# EAGLE schematic v2 (EAGLE 6.6.0)
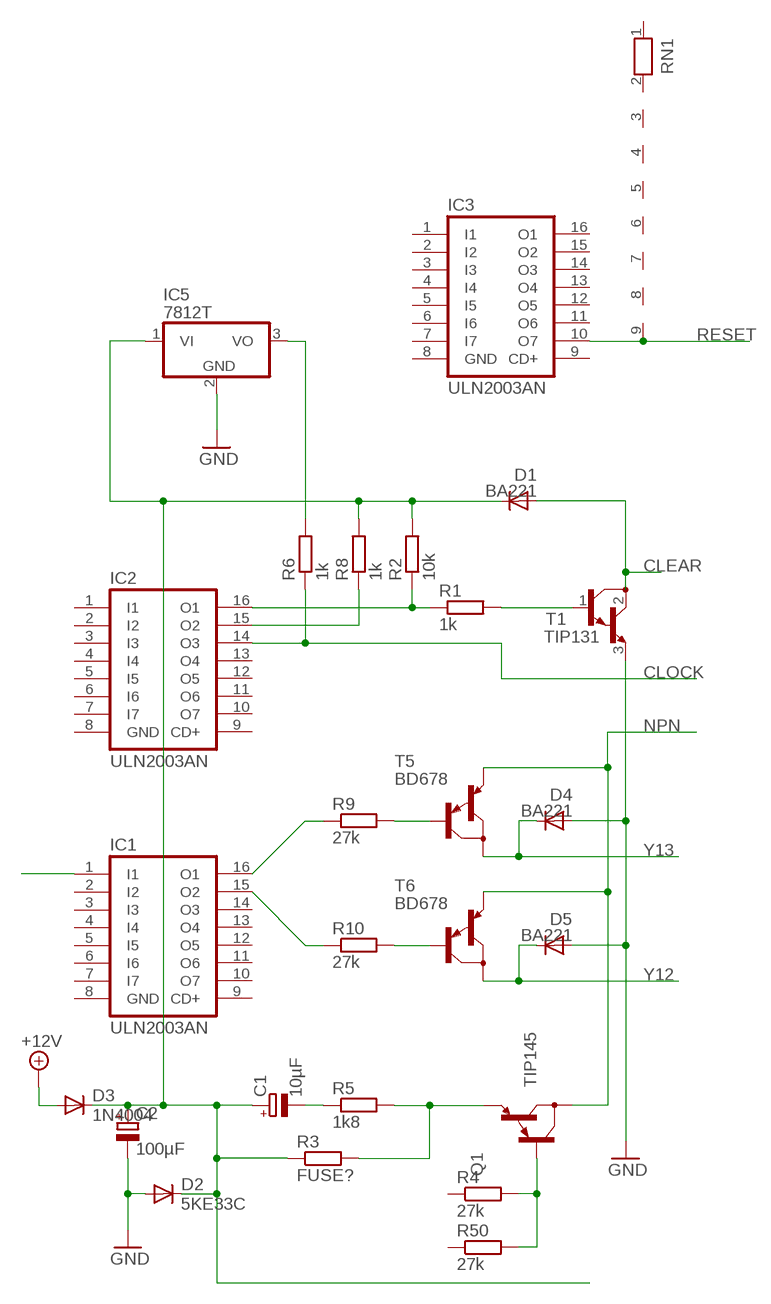
[diagram p0: schematic, sheet 1]

## Parts
C1  10µF  CPOL-EUE2.5-6  [E2,5-6]
C2  100µF  CPOL-EUE2.5-7  [E2,5-7]
D1  BA221  [DO35-10]
D2  5KE33C  1N4004  [DO41-10]
D3  1N4004  [DO41-10]
D4  BA221  [DO35-10]
D5  BA221  [DO35-10]
IC1  ULN2003AN  [DIL16]
IC2  ULN2003AN  [DIL16]
IC3  ULN2003AN  [DIL16]
IC5  7812T  [TO220H]
Q1  TIP145  TIP136  [TO220]
R1  1k  R-EU_0309/12  [0309/12]
R2  10k  R-EU_0309/12  [0309/12]
R3  FUSE?  R-EU_0309/12  [0309/12]
R4  27k  R-EU_0309/12  [0309/12]
R5  1k8  R-EU_0309/12  [0309/12]
R6  1k  R-EU_0309/12  [0309/12]
R8  1k  R-EU_0309/12  [0309/12]
R9  27k  R-EU_0309/12  [0309/12]
R10  27k  R-EU_0309/12  [0309/12]
R50  27k  R-EU_0309/12  [0309/12]
RN1  RN08  [RN-9]
T1  TIP131  [TO220]
T5  BD678  BD676  [TO126]
T6  BD678  BD676  [TO126]

## Nets
+12V: D3.A
CLEAR: D1.A T1.2(C)
CLOCK: IC2.14(O3) R6.1
GND: C2.- D2.A D4.A D5.A IC5.2(GND) T1.3(E)
N$1: R1.2 T1.1(B)
N$3: IC1.1(I1)
N$4: R9.2 T5.3(B)
N$5: Q1.1(B) R4.2 R50.2
N$6: Q1.3(E) R3.2 R5.2
N$7: C1.- R5.1
N$8: IC1.16(O1) R9.1
N$9: IC1.15(O2) R10.1
N$10: R10.2 T6.3(B)
N$11: IC2.15(O2) R8.1
N$12: IC2.16(O1) R1.1 R2.1
N$13: C1.+ C2.+ D1.C D2.C D3.C IC5.1(VI) R2.2 R3.1 R8.2
N$15: IC5.3(VO) R6.2
NPN: Q1.2(C) T5.1(E) T6.1(E)
RESET: IC3.10(O7) RN1.9
Y12: D5.C T6.2(C)
Y13: D4.C T5.2(C)
Unconnected: IC1.2(I2) IC1.3(I3) IC1.4(I4) IC1.5(I5) IC1.6(I6) IC1.7(I7) IC1.9(CD+) IC1.10(O7) IC1.11(O6) IC1.12(O5) IC1.13(O4) IC1.14(O3) IC2.1(I1) IC2.2(I2) IC2.3(I3) IC2.4(I4) IC2.5(I5) IC2.6(I6) IC2.7(I7) IC2.9(CD+) IC2.10(O7) IC2.11(O6) IC2.12(O5) IC2.13(O4) IC3.1(I1) IC3.2(I2) IC3.3(I3) IC3.4(I4) IC3.5(I5) IC3.6(I6) IC3.7(I7) IC3.9(CD+) IC3.11(O6) IC3.12(O5) IC3.13(O4) IC3.14(O3) IC3.15(O2) IC3.16(O1) R4.1 R50.1 RN1.1 RN1.2 RN1.3 RN1.4 RN1.5 RN1.6 RN1.7 RN1.8

## Power pins joined to a net without a drawn wire
GND: IC1.8(GND) IC2.8(GND) IC3.8(GND)

## Library data of the parts
C1 C2 = rcl:CPOL-EU: POLARIZED CAPACITOR, European symbol
D1 D4 D5 = diode:BA221: DIODE high speed (Philips)
D2 D3 = diode:1N4004: DIODE general purpose rectifier, 1 A
IC1-IC3 = uln-udn:ULN2003A: DRIVER ARRAY
IC5 = linear:78*: Positive VOLTAGE REGULATOR Source: http://cache.national.com/ds/LM/LM78L05.pdf http://www.fairchildsemi.com/ds/LM/LM7805.pdf
Q1 = transistor-pnp:TIP136: PNP Darlington Transistor
R1-R6 R8-R10 R50 = rcl:R-EU_: RESISTOR, European symbol
RN1 = resistor-net:RN08: RESISTOR NETWORK; OC_FARNELL: unknown; OC_NEWARK: unknown
T1 = transistor:TIP131: NPN BIPOLAR DARLINGTON TRANSISTOR
T5 T6 = transistor-pnp:BD676: PNP Darlington Transistor